# Altium schematic sheet Volant5.Power.SchDoc
size A4
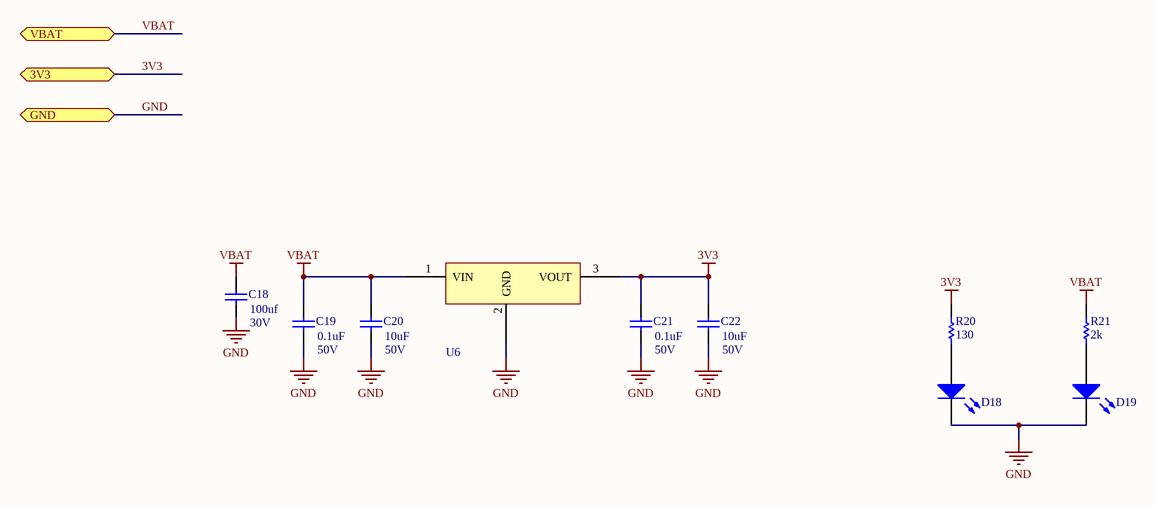
[diagram p0: Volant5.Power.SchDoc]

## Parts
C18  value 100uf  VOLTAGE: 30V  [CS-0603]  (hidden comment: CS - CAPACITOR)
C19  value 0.1uF  VOLTAGE: 50V  [CS-0603]  (hidden comment: CS - CAPACITOR)
C20  value 10uF  VOLTAGE: 50V  [CS-0603]  (hidden comment: CS - CAPACITOR)
C21  value 0.1uF  VOLTAGE: 50V  [CS-0603]  (hidden comment: CS - CAPACITOR)
C22  value 10uF  VOLTAGE: 50V  [CS-0603]  (hidden comment: CS - CAPACITOR)
D18  LED - NORMAL LED  [LED-0805 YELLOW]  (value not drawn)
D19  LED - NORMAL LED  [LED-0805 YELLOW]  (value not drawn)
R20  value 130  [RS-0603]  (hidden comment: RS - RESISTOR)
R21  value 2k  [RS-0603]  (hidden comment: RS - RESISTOR)
U6  OKI-78SR  [IC-OKI78SR-RA]  (value not drawn)

## Ports
3V3, GND, VBAT

## Nets
3V3: C21.2 C22.2 R20.2 U6.3(VOUT) ; port 3V3
GND: C18.1 C19.1 C20.1 C21.1 C22.1 D18.K D19.K U6.2(GND) ; port GND
VBAT: C18.2 C19.2 C20.2 R21.2 U6.1(VIN) ; port VBAT
NetD18_A: D18.A R20.1
NetD19_A: D19.A R21.1

## Library data of the parts
C18-C22 = CS - CAPACITOR: TOLERANCE: 10%; Supplier 1: *; (FIELD A): *; (FLIED C): *; (FIELD B): *; Manufacturer: *
  C18: Supplier Part Number 1: 493-1355-ND
  C19 C21: Supplier Part Number 1: 399-5089-1-ND
  C20 C22: Supplier Part Number 1: 587-3238-1-ND
R20 R21 = RS - RESISTOR: TOLERANCE: RES TOL; POWER: RES POWER; Supplier 1: *; (FIELD A): *; (FLIED C): *; (FIELD B): *; Manufacturer: *
  R20: Supplier Part Number 1: RHM150CFCT-ND
  R21: Supplier Part Number 1: ERJ-3EKF2001V
U6 = IC - OKI-78SR: Supplier 1: Digi-Key; Supplier Part Number 1: 811-2195-5-ND; (FIELD A): *; (FIELD B): *; (FIELD C): *; Manufacturer: *
D18 D19 = LED - NORMAL LED: FORWARS VOLTAGE: *; CURRENT: *; COLOR: *; Supplier Part Number 1: *; Supplier 1: *; (FIELD B): *; (FIELD A): *; (FIELD C): *; Manufacturer: *